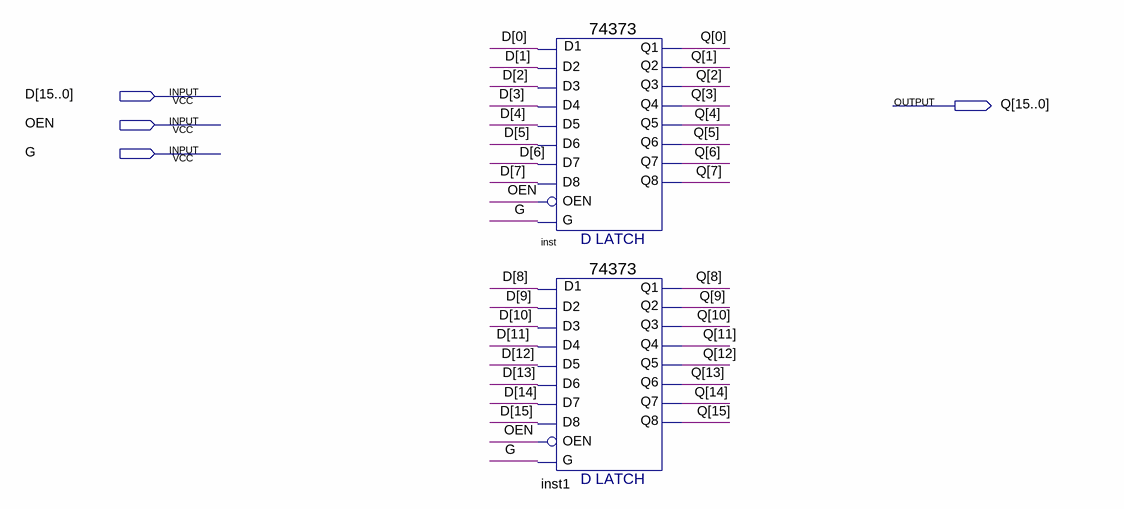
[diagram p0: schematic sheet]
// Quartus schematic 74373_16.bdf as structural Verilog: 2 symbols, 4 pins
module \74373_16  (
  input  [15:0] D,
  input  OEN,
  input  G,
  output [15:0] Q
);

  \74373  inst (
    .D1(D[0]), .D3(D[2]), .D6(D[5]), .D7(D[6]), .D2(D[1]), .G(G), .D4(D[3]), .D5(D[4]), .D8(D[7]), .OEN(OEN),
    .Q3(Q[2]), .Q6(Q[5]), .Q7(Q[6]), .Q2(Q[1]), .Q8(Q[7]), .Q4(Q[3]), .Q5(Q[4]), .Q1(Q[0]));
  \74373  inst1 (
    .D1(D[8]), .D3(D[10]), .D6(D[13]), .D7(D[14]), .D2(D[9]), .G(G), .D4(D[11]), .D5(D[12]), .D8(D[15]),
    .OEN(OEN), .Q3(Q[10]), .Q6(Q[13]), .Q7(Q[14]), .Q2(Q[9]), .Q8(Q[15]), .Q4(Q[11]), .Q5(Q[12]), .Q1(Q[8]));
endmodule
